# Altium schematic sheet BMS.SchDoc
size 420 x 297 mm; SheetNumber: 2; SheetTotal: 3
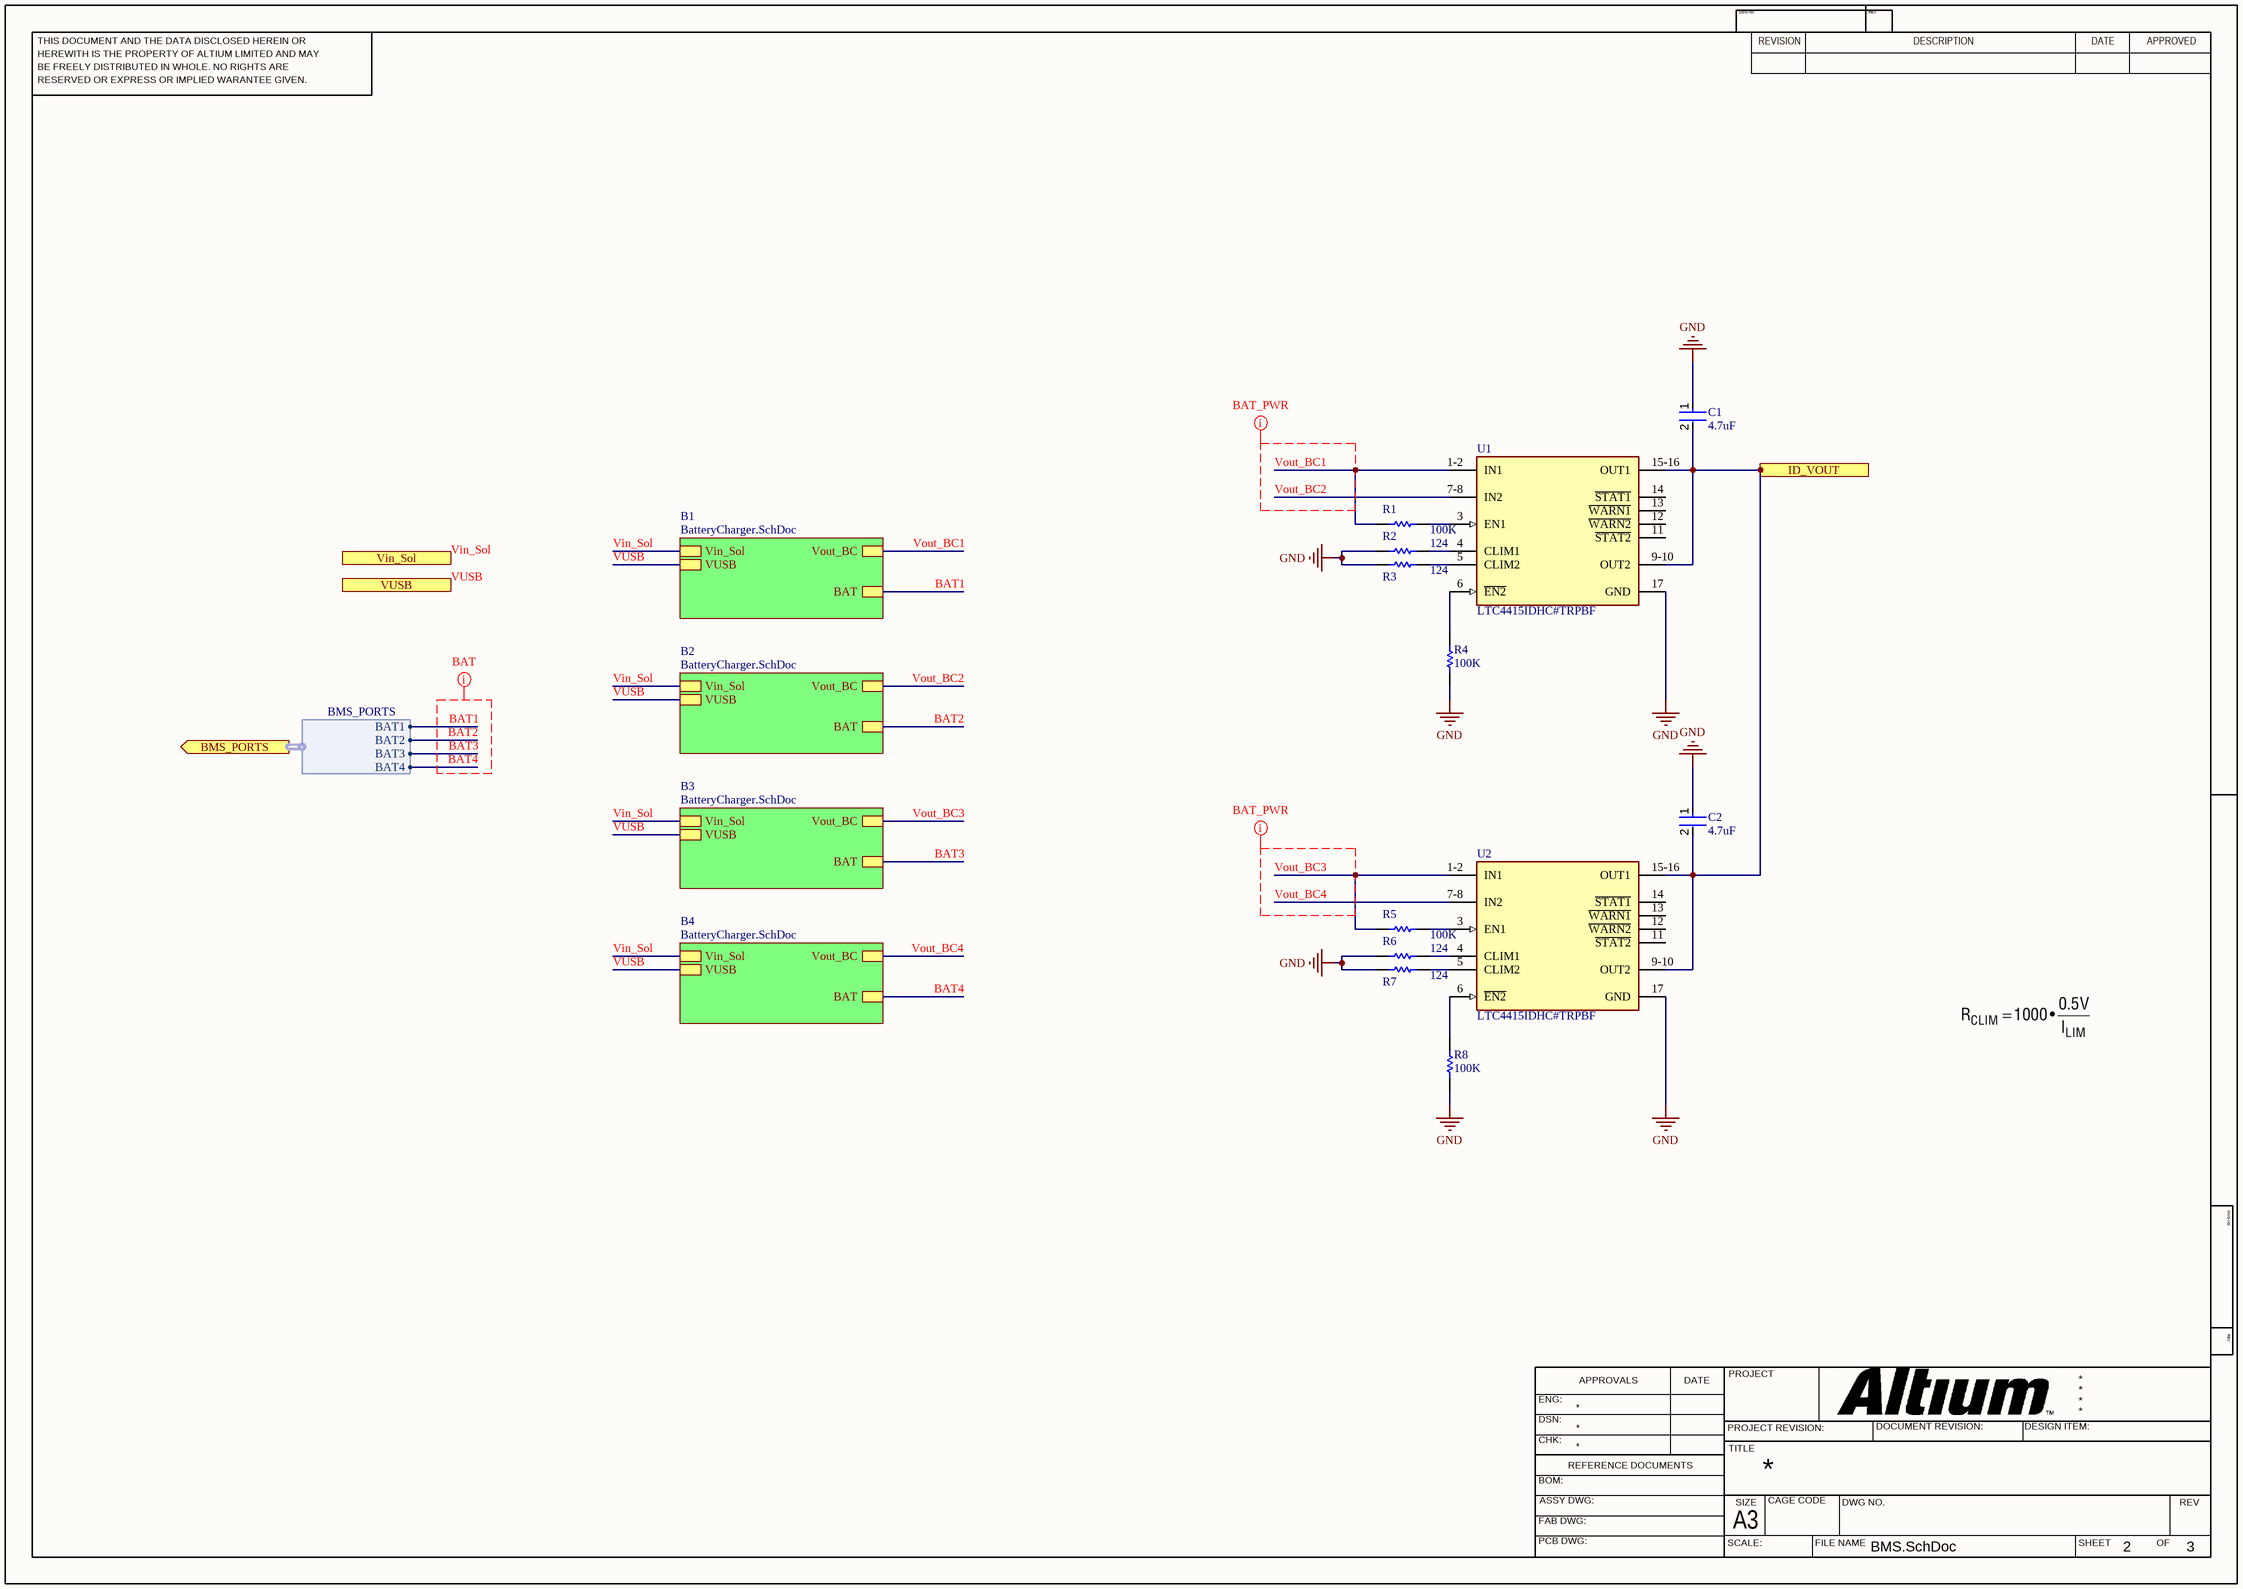
[diagram p0: BMS.SchDoc]

## Parts
C1  4.7uF  [FP-GRM188-0_15-IPC_A]
C2  4.7uF  [FP-GRM188-0_15-IPC_A]
R1  100K  [RESC1608X55X30ML20T10]
R2  124  [RESC1608X55X30NL20T20]
R3  124  [RESC1608X55X30NL20T20]
R4  100K  [RESC1608X55X30ML20T10]
R5  100K  [RESC1608X55X30ML20T10]
R6  124  [RESC1608X55X30NL20T20]
R7  124  [RESC1608X55X30NL20T20]
R8  100K  [RESC1608X55X30ML20T10]
U1  LTC4415IDHC#TRPBF  [FP-DHC-16-05-08-1872-MFG]
U2  LTC4415IDHC#TRPBF  [FP-DHC-16-05-08-1872-MFG]

## Sub-sheets
B1 = BatteryCharger.SchDoc: Vin_Sol, BAT, VUSB, Vout_BC
B2 = BatteryCharger.SchDoc: Vin_Sol, BAT, VUSB, Vout_BC
B3 = BatteryCharger.SchDoc: Vin_Sol, BAT, VUSB, Vout_BC
B4 = BatteryCharger.SchDoc: Vin_Sol, BAT, VUSB, Vout_BC

## Ports
BMS_PORTS (out, harness BMS_PORTS), ID_VOUT, Vin_Sol, VUSB

## Harnesses
BMS_PORTS: BAT1, BAT2, BAT3, BAT4

## Nets
GND: C1.1 C2.1 R2.1 R3.1 R4.2 R6.1 R7.1 R8.2 U1.17(GND) U2.17(GND)
BAT1: sheet B1/BAT, port BMS_PORTS.BAT1
BAT2: sheet B2/BAT, port BMS_PORTS.BAT2
BAT3: sheet B3/BAT, port BMS_PORTS.BAT3
BAT4: sheet B4/BAT, port BMS_PORTS.BAT4
ID_VOUT: C1.2 C2.2 U1.9-10(OUT2) U1.15-16(OUT1) U2.9-10(OUT2) U2.15-16(OUT1) ; port ID_VOUT
Vin_Sol: port Vin_Sol, sheet B1/Vin_Sol, sheet B2/Vin_Sol, sheet B3/Vin_Sol, sheet B4/Vin_Sol
Vout_BC1: R1.2 U1.1-2(IN1) ; sheet B1/Vout_BC
Vout_BC2: U1.7-8(IN2) ; sheet B2/Vout_BC
Vout_BC3: R5.2 U2.1-2(IN1) ; sheet B3/Vout_BC
Vout_BC4: U2.7-8(IN2) ; sheet B4/Vout_BC
VUSB: port VUSB, sheet B1/VUSB, sheet B2/VUSB, sheet B3/VUSB, sheet B4/VUSB
NetR1_1: R1.1 U1.3(EN1)
NetR2_2: R2.2 U1.4(CLIM1)
NetR3_2: R3.2 U1.5(CLIM2)
NetR4_1: R4.1 U1.6(~{EN2})
NetR5_1: R5.1 U2.3(EN1)
NetR6_2: R6.2 U2.4(CLIM1)
NetR7_2: R7.2 U2.5(CLIM2)
NetR8_1: R8.1 U2.6(~{EN2})

Not connected (* = marked no-connect by the designer): U1 11(~{STAT2}) 12(~{WARN2}) 13(~{WARN1}) 14(~{STAT1}); U2 11(~{STAT2}) 12(~{WARN2}) 13(~{WARN1}) 14(~{STAT1})

## Layout directives
net class BAT: BAT1, BAT2, BAT3, BAT4
net class BAT_PWR: Vout_BC1, Vout_BC2, Vout_BC3, Vout_BC4

## Notes on the sheet
- THIS DOCUMENT AND THE DATA DISCLOSED HEREIN OR
- HEREWITH IS THE PROPERTY OF ALTIUM LIMITED AND MAY
- DWG NO:
- REVISION
- REV:
- DESCRIPTION
- DATE
- APPROVED
- BE FREELY DISTRIBUTED IN WHOLE. NO RIGHTS ARE
- RESERVED OR EXPRESS OR IMPLIED WARANTEE GIVEN.
- ENG:
- APPROVALS
- PROJECT
- DSN:
- CHK:
- REFERENCE DOCUMENTS
- PROJECT REVISION:
- TITLE
- DOCUMENT REVISION:
- DESIGN ITEM:
- BOM:
- FAB DWG:
- PCB DWG:
- ASSY DWG:
- SCALE:
- A3
- SIZE
- CAGE CODE
- FILE NAME
- DWG NO.
- SHEET
- OF
- REV

## Library data of the parts
C1 C2 = CMP-06035-000034-2: CAP CER 4.7UF 10V X7S 0603; Material: Ceramic; Tolerance: 10%; Height: 0.8mm; Termination: SMD/SMT; Case Code (Metric): 1608; Voltage Rating: 10V; Width: 0.8mm; Resistor Type: Ceramic; Length: 1.6mm; Voltage Rating (DC): 10V; Weight: 0.000222oz; Dielectric: X7S; Package Quantity: 4000; Mount: Surface Mount; Case Code (Imperial): 0603; Case/Package: 0603; Packaging: Tape and Reel; Thickness: 0.037inch; Min Operating Temperature: -55°C; Capacitance: 4.7uF; Max Operating Temperature: 125°C
R1 R4 R5 R8 = CMP-2000-01852-1: Part Number: RK73B1JTTD104J; Manufacturer: KOA Speer
R2 R3 R6 R7 = CMP-2000-00899-1: Part Number: ERA3AEB1240V; Manufacturer: Panasonic
U1 U2 = CMP-0479-00071-2: IC OR CTRLR SRC SELECT 16DFN; Operating Supply Current: 44uA; Max Output Current: 4A; Case/Package: DFN; Series: PowerPath™; Packaging: Tape and Reel; Lead Free: Lead Free; RoHS Compliant: Yes; Package Quantity: 2500; Max Operating Temperature: 125°C; Min Operating Temperature: -40°C; Number of Pins: 16; Length: 5mm